# Altium project QuadTofDeck_v2.PrjPcb
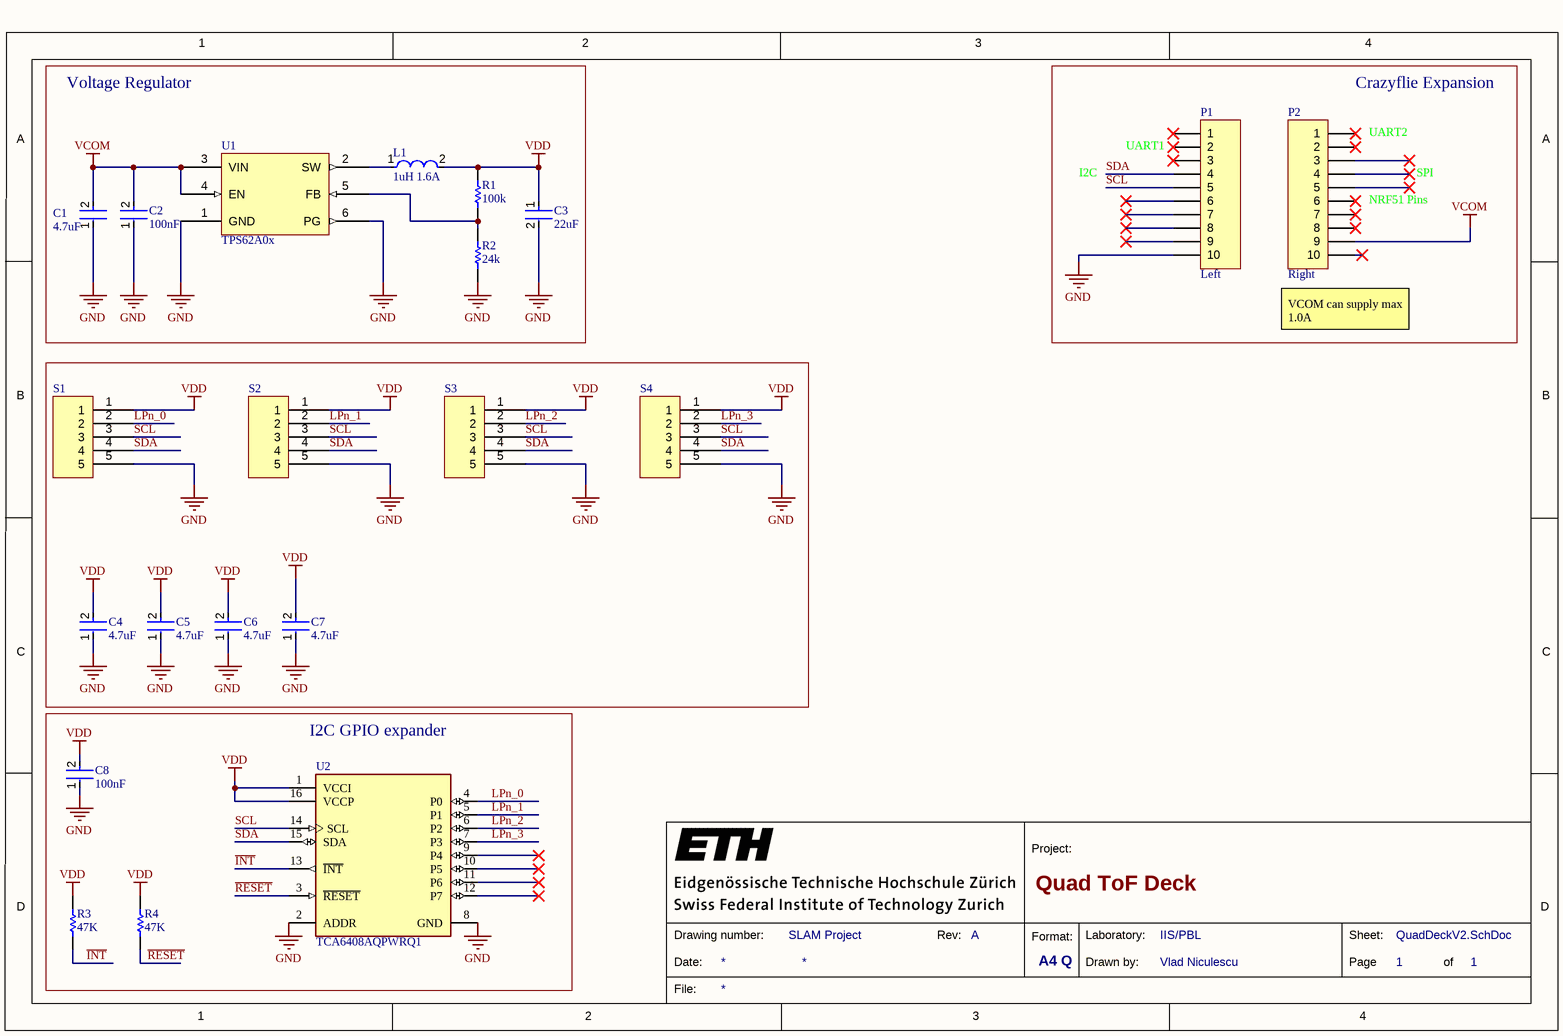
[diagram p0: QuadDeckV2.SchDoc]
1 sheet, 21 parts. Net scope: global (net labels, ports and power ports of the same name join across sheets).
Board file: QuadDeckV2.PcbDoc

## Sheet QuadDeckV2.SchDoc: Quad ToF Deck
size A4; Author: Vlad Niculescu; CompanyName: ETH Zürich; DrawnBy: Vlad Niculescu; Engineer: Vlad Niculescu; Organization: IIS/PBL; DocumentNumber: SLAM Project; Revision: A; SheetNumber: 1; SheetTotal: 1

### Parts
C1  4.7uF  [FP-GRM188-0_1-MFG]
C2  100nF  [FP-GRM15-MFG]
C3  22uF  [FP-GRM21B-0_15-MFG]
C4  4.7uF  [FP-GRM188-0_1-MFG]
C5  4.7uF  [FP-GRM188-0_1-MFG]
C6  4.7uF  [FP-GRM188-0_1-MFG]
C7  4.7uF  [FP-GRM188-0_1-MFG]
C8  100nF  [FP-GRM15-MFG]
L1  1uH 1.6A  [FP-LQM21PN_EH-w1_5-IPC_A]
P1  Left  [PCBComponent_1]
P2  Right  [PCBComponent_1]
R1  100k  [RESC1608X55X30ML20T20]
R2  24k  [RESC0603(1608)_N]
R3  47K  [RESC1608X55X30NL15T15]
R4  47K  [RESC1608X55X30NL15T15]
S1  Component_1  [tof-connector]  (value not drawn)
S2  Component_1  [tof-connector]  (value not drawn)
S3  Component_1  [tof-connector]  (value not drawn)
S4  Component_1  [tof-connector]  (value not drawn)
U1  TPS62A0x  [SOT50P245X110-6N]
U2  TCA6408AQPWRQ1  [FP-PW0016A-IPC_B]

### Blocks framed on the sheet
Voltage Regulator: C1-C3 L1 R1 R2 U1
Crazyflie Expansion: P1 P2
I2C GPIO expander: C8 R3 R4 U2

### Nets
GND: C1.1 C2.1 C3.2 C4.1 C5.1 C6.1 C7.1 C8.1 P1.10 R2.1 S1.5 S2.5 S3.5 S4.5 U1.1(GND) U1.6(PG) U2.2(ADDR) U2.8(GND)
VCOM: C1.2 C2.2 P2.9 U1.3(VIN) U1.4(EN)
VDD: C3.1 C4.2 C5.2 C6.2 C7.2 C8.2 L1.2 R1.2 R3.2 R4.2 S1.1 S2.1 S3.1 S4.1 U2.1(VCCI) U2.16(VCCP)
~{INT}: R3.1 U2.13(~{INT})
~{RESET}: R4.1 U2.3(~{RESET})
LPn_0: S1.2 U2.4(P0)
LPn_1: S2.2 U2.5(P1)
LPn_2: S3.2 U2.6(P2)
LPn_3: S4.2 U2.7(P3)
SCL: P1.5 S1.3 S2.3 S3.3 S4.3 U2.14(SCL)
SDA: P1.4 S1.4 S2.4 S3.4 S4.4 U2.15(SDA)
NetL1_1: L1.1 U1.2(SW)
NetR1_1: R1.1 R2.2 U1.5(FB)

Not connected (* = marked no-connect by the designer): P1 1* 2* 3* 6* 7* 8* 9*; P2 1* 2* 3* 4* 5* 6* 7* 8* 10*; U2 9(P4)* 10(P5)* 11(P6)* 12(P7)*

### Notes on the sheet
- I2C
- (near P1) UART1
- (near P2) UART2
- SPI
- (near P2) NRF51 Pins
- (near P2) VCOM can supply max 1.0A
- 1
- 2
- 3
- 4
- A
- B
- C
- Project:
- D
- Date:
- Drawing number:
- Rev:
- Format:
- A4 Q
- Drawn by:
- Laboratory:
- Page
- Sheet:
- of
- File:

### Library data of the parts
C1 C4-C7 = CMP-2006-02799-3: CAP CER 4.7UF 6.3V X5R 0603; Material: Ceramic; Tolerance: 10%; Max Operating Temperature: 85°C; REACH SVHC: No SVHC; Thickness: 0.035inch; Voltage Rating: 6.3V; Package Quantity: 1; Radiation Hardening: No; Capacitance: 4.7uF; Voltage: 6.3V; Case Code (Metric): 1608; Dielectric: X5R; Mount: Surface Mount; RoHS Compliant: Yes; Height: 0.8mm; Voltage Rating (DC): 6.3V; Width: 0.8mm; Lead Free: Lead Free; Case Code (Imperial): 0603; Packaging: Tape and Reel; Length: 1.6mm; Case/Package: 0603; Termination: SMD/SMT; Min Operating Temperature: -55°C; Depth: 0.8mm
C2 C8 = CMP-2100-03641-2: CAP CER 0.1UF 16V X7R 0402; Manufacturer Part Number: GRM155R71C104KA88D; Manufacturer: Murata; Standoff Height: 0mm; Tolerance: 10%; Voltage Rating: 16Vdc; Material: Ceramic; Capacitance: 0.10μF; Value: 0.10μF; RoHS: TRUE; Temperature Characteristic: X7R; Octopart: https://octopart.com/grm155r71c104ka88d-murata-196880; Digikey Description: CAP CER 0.1UF 16V X7R 0402; Device Class L3: Ceramic Capacitors; Height: 0.55mm; ComponentLink2Description: Datasheet; Temperature Range Low: -55°C; Ipc Land Pattern Name: CAPC10050X219; ComponentLink2URL: https://search.murata.co.jp/Ceramy/image/img/A01X/G101/ENG/GRM155R71H471KA01-01A.pdf; Device Class L1: Passive Components; Lead Free: yes; Category: Cap; Package: GRM15; Temperature: -55°C to +125°C; Device Class L2: Capacitors; Temperature Range High: +125°C; Mouser Description: 0402 0.1 uF 16V ±10 % Tolerance X7R SMT Multilayer Ceramic Capacitor
C3 = CMP-2007-03385-2: Chip Multilayer Ceramic Capacitors for General Purpose, 0805, 22uF, X5R, 15%, 20%, 6.3V; Material: Ceramic; Max Operating Temperature: 85°C; Voltage: 6.3V; Min Operating Temperature: -55°C; Case/Package: 0805; Thickness: 0.053inch; Dielectric: X5R; Packaging: Tape and Reel; Depth: 1.25mm; Termination: SMD/SMT; Voltage Rating (DC): 6.3V; Radiation Hardening: No; Tolerance: 20%; Mount: Surface Mount; Lead Free: Lead Free; Package Quantity: 1; REACH SVHC: No SVHC; Voltage Rating: 6.3V; Capacitance: 22uF; Length: 2mm; Case Code (Imperial): 0805; Case Code (Metric): 2012; Width: 0.049inch; Height: 1.25mm
L1 = CMP-06042-012339-2: FIXED IND 1UH 1.6A 107 MOHM SMD; Core Material: Ferrite; DC Resistance (DCR): 107mR; Saturation Current: 1A; Self Resonant Frequency: 50MHz; Test Frequency: 1MHz; Tolerance: 20%; Shielding: Shielded; Packaging: Tape and Reel; Max Operating Temperature: 85°C; Case Code (Metric): 2012; Case Code (Imperial): 0805; Mount: Surface Mount; RoHS Compliant: Yes; Current Rating: 1.6A; Inductance: 1uH; Min Operating Temperature: -40°C; Case/Package: 0805
P1 P2 = MHDR1X10: Header, 10-Pin; LatestRevisionDate: 17-Jul-2002; LatestRevisionNote: Re-released for DXP Platform.; Publisher: Altium Limited
R1 = CMP-2000-00875-1: Part Number: ERA3AEB104V; Manufacturer: Panasonic
R2 = CMP-1012-00107-1: 24K 0.1W 5% 0603 (1608 Metric)  SMD; Case-Metric: 1608; Case-EIA: 0603; Value: 24000.00 Ohm; Tolerance: 5 %; Technology: SMT; Power: 0.1 W
R3 R4 = CMP-2000-00523-2: Chip Resistor, 47 KOhm, +/- 1%, 0.1 W, -55 to 155 degC, 0603 (1608 Metric), RoHS, Tape and Reel; Case\Package: 0603; Forward Current: 20 mA; Power Rating: 90 mW; Illumination Colour: Red; Nominal Vf: 2.1 V; Viewing Angle: 160 degrees; Luminous Intensity: 63 mcd; Lens Style: Clear; Nominal Wavelength: 639 nm; Case Code (Imperial): 0603; Case Code (Metric): 1608; Packaging: Tape and Reel; Radiation Hardening: No; Colour: Red; PackageDescription: 2-Pin Surface Mount Device, Body 1.6 x 0.85 mm; ComponentLink1Description: Manufacturer URL; Width: 0.8 mm; DatasheetVersion: Apr-15; ComponentLink2URL: http://industrial.panasonic.com/cdbs/www-data/pdf/RDA0000/AOA0000C86.pdf; Min Operating Temperature: -40 degC; Height: 0.6 mm; Package Quantity: 3000; ComponentLink2Description: Datasheet; REACH SVHC: No SVHC; ComponentLink1URL: http://www.panasonic.com/; Mount: Surface Mount; RoHSCompliant: true; Max Operating Temperature: 100 degC; PackageReference: 0603; Length: 1.6 mm; Forward Voltage: 2.1 V; Pins: 2
U1 = TPS62A01
U2 = CMP-04886-000007-1: IC I/O EXPANDER I2C 8B 16TSSOP; Number of I/Os: 8; Lead Free: Lead Free; Min Operating Temperature: -40°C; Case/Package: TSSOP; RoHS Compliant: Yes; Max Operating Temperature: 125°C

## Assembly variants
Production: not fitted A1 P1 P2 P3 P4 R2 R8 R11 R12 TP1 TP2